# Altium project MacroQMK.PrjPcb
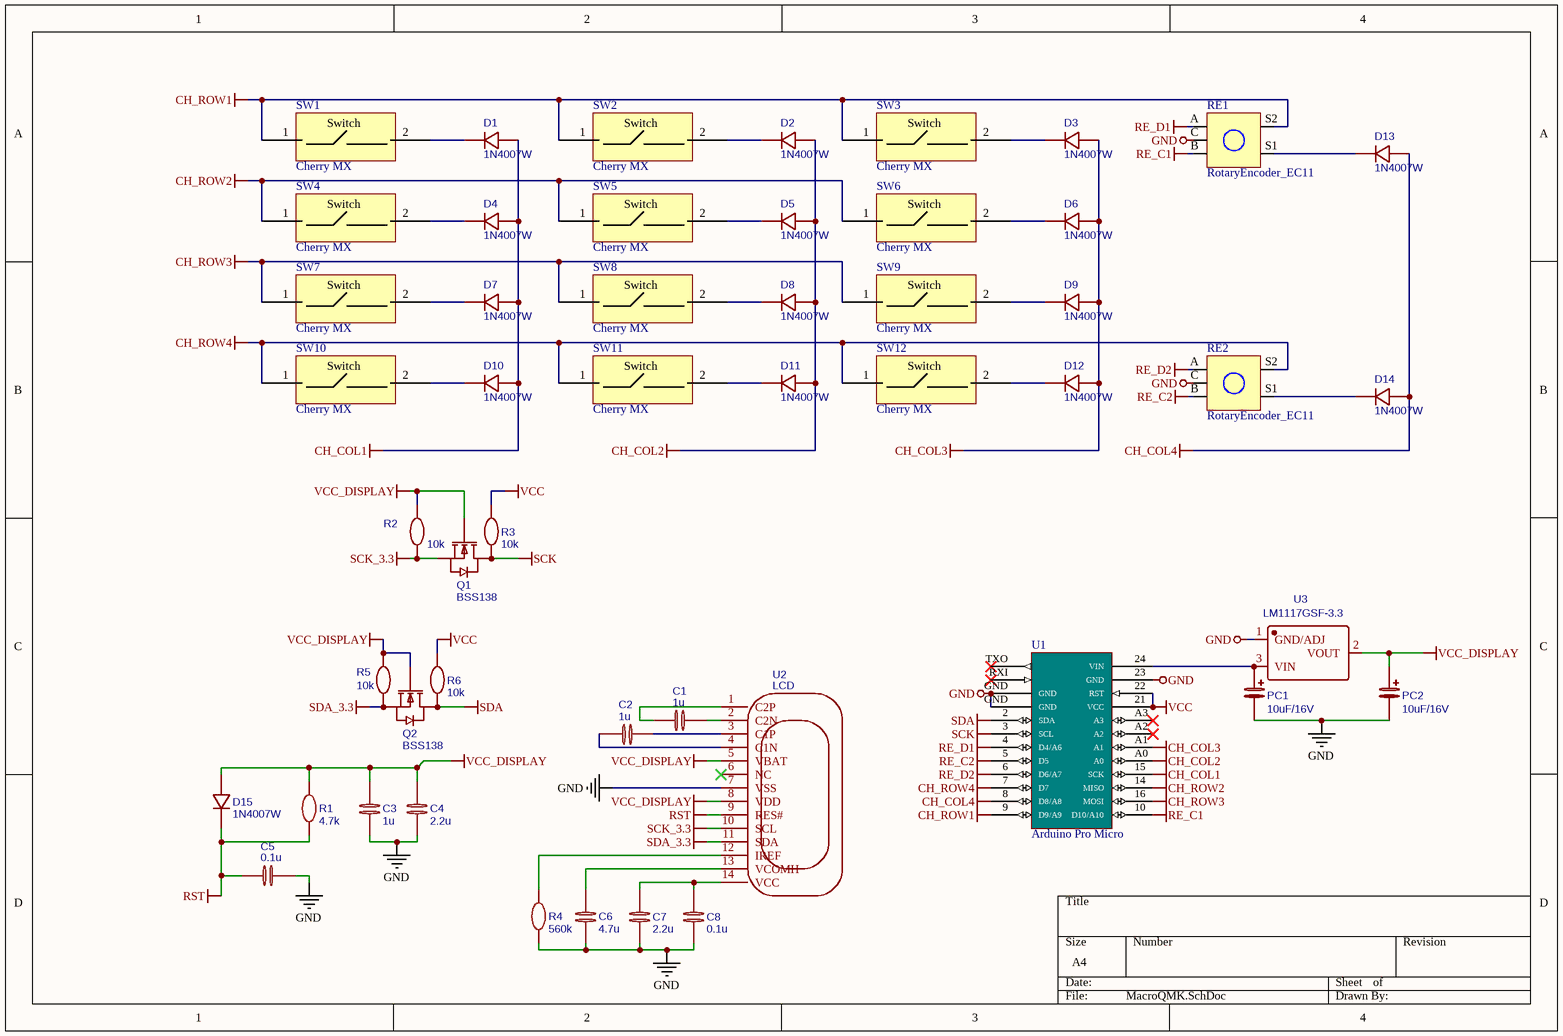
[diagram p0: MacroQMK.SchDoc]
1 sheet, 50 parts. Net scope: global (net labels, ports and power ports of the same name join across sheets).
Board file: MacroQMK.PcbDoc

## Sheet MacroQMK.SchDoc
size A4; SheetNumber: 1; SheetTotal: 1

### Parts
C1  1u  [C0603]
C2  1u  [C0603]
C3  1u  [C0603]
C4  2.2u  [C0603]
C5  0.1u  [C0603]
C6  4.7u  [C0603]
C7  2.2u  [C0603]
C8  0.1u  [C0603]
D1  1N4007W  [SOD123F]
D2  1N4007W  [SOD123F]
D3  1N4007W  [SOD123F]
D4  1N4007W  [SOD123F]
D5  1N4007W  [SOD123F]
D6  1N4007W  [SOD123F]
D7  1N4007W  [SOD123F]
D8  1N4007W  [SOD123F]
D9  1N4007W  [SOD123F]
D10  1N4007W  [SOD123F]
D11  1N4007W  [SOD123F]
D12  1N4007W  [SOD123F]
D13  1N4007W  [SOD123F]
D14  1N4007W  [SOD123F]
D15  1N4007W  [SOD123F]
PC1  10uF/16V  [CAP POL 1206_3216]
PC2  10uF/16V  [CAP POL 1206_3216]
Q1  BSS138  [MICROCHIP SOT-23-3 NB]
Q2  BSS138  [MICROCHIP SOT-23-3 NB]
R1  4.7k  [RES 0402_1005]
R2  10k  [R0603]
R3  10k  [R0603]
R4  560k  [R0603]
R5  10k  [R0603]
R6  10k  [R0603]
RE1  RotaryEncoder_EC11  [RotaryEncoder_EC11]
RE2  RotaryEncoder_EC11  [RotaryEncoder_EC11]
SW1  Cherry MX  [MX_Cherry]
SW2  Cherry MX  [MX_Cherry]
SW3  Cherry MX  [MX_Cherry]
SW4  Cherry MX  [MX_Cherry]
SW5  Cherry MX  [MX_Cherry]
SW6  Cherry MX  [MX_Cherry]
SW7  Cherry MX  [MX_Cherry]
SW8  Cherry MX  [MX_Cherry]
SW9  Cherry MX  [MX_Cherry]
SW10  Cherry MX  [MX_Cherry]
SW11  Cherry MX  [MX_Cherry]
SW12  Cherry MX  [MX_Cherry]
U1  Arduino Pro Micro  [ArduinoProMicro]
U2  LCD  [GCT FFC2B28-14]
U3  LM1117GSF-3.3  [NEXPERIA SOT-223 BZV90]

### Nets
CH_COL1: D1.2 D4.2 D7.2 D10.2 U1.15(SCK)
CH_COL2: D2.2 D5.2 D8.2 D11.2 U1.A0
CH_COL3: D3.2 D6.2 D9.2 D12.2 U1.A1
CH_COL4: D13.2 D14.2 U1.8(D8/A8)
CH_ROW1: RE1.S2 SW1.1 SW2.1 SW3.1 U1.9(D9/A9)
CH_ROW2: SW4.1 SW5.1 SW6.1 U1.14(MISO)
CH_ROW3: SW7.1 SW8.1 SW9.1 U1.16(MOSI)
CH_ROW4: RE2.S2 SW10.1 SW11.1 SW12.1 U1.7(D7)
GND: C3.1 C4.1 C5.2 C6.1 C7.1 C8.1 PC1.2 PC2.2 R4.1 RE1.C RE2.C U1.23(GND) U1.GND U2.7(VSS) U3.1(GND/ADJ)
RE_C1: RE1.B U1.10(D10/A10)
RE_C2: RE2.B U1.5(D5)
RE_D1: RE1.A U1.4(D4/A6)
RE_D2: RE2.A U1.6(D6/A7)
RST: C5.1 D15.1 R1.1 U2.9(RES#)
SCK: Q1.3(D) R3.2 U1.3(SCL)
SCK_3.3: Q1.2(S) R2.2 U2.10(SCL)
SDA: Q2.3(D) R6.2 U1.2(SDA)
SDA_3.3: Q2.2(S) R5.2 U2.11(SDA)
VCC: R3.1 R6.1 U1.21(VCC) U1.22(RST)
VCC_DISPLAY: C3.2 C4.2 D15.2 PC2.1 Q1.1(G) Q2.1(G) R1.2 R2.1 R5.1 U2.5(VBAT) U2.8(VDD) U3.2(VOUT)
NetC1_1: C1.1 U2.1(C2P)
NetC1_2: C1.2 U2.2(C2N)
NetC2_1: C2.1 U2.3(C1P)
NetC2_2: C2.2 U2.4(C1N)
NetC6_2: C6.2 U2.13(VCOMH)
NetC7_2: C7.2 C8.2 U2.14(VCC)
NetD1_1: D1.1 SW1.2
NetD2_1: D2.1 SW2.2
NetD3_1: D3.1 SW3.2
NetD4_1: D4.1 SW4.2
NetD5_1: D5.1 SW5.2
NetD6_1: D6.1 SW6.2
NetD7_1: D7.1 SW7.2
NetD8_1: D8.1 SW8.2
NetD9_1: D9.1 SW9.2
NetD10_1: D10.1 SW10.2
NetD11_1: D11.1 SW11.2
NetD12_1: D12.1 SW12.2
NetD13_1: D13.1 RE1.S1
NetD14_1: D14.1 RE2.S1
NetPC1_1: PC1.1 U1.24(VIN) U3.3(VIN)
NetR4_2: R4.2 U2.12(IREF)

Not connected (* = marked no-connect by the designer): U1 A2* A3* RXI* TXO*; U2 6(NC)*

### Notes on the sheet
- (in symbol MX_Cherry) Switch

### Library data of the parts
C1-C3 = 1u: nameAlias: Value(F); Contributor: LCEDA_Lib; spicePre: C; spiceSymbolName: C_0603_EU
C4 C7 = 2.2u: nameAlias: Value(F); Contributor: LCEDA_Lib; spicePre: C; spiceSymbolName: C_0603_EU
C5 C8 = 0.1u: nameAlias: Value(F); Contributor: LCEDA_Lib; spicePre: C; spiceSymbolName: C_0603_EU
C6 = 4.7u: nameAlias: Value(F); Contributor: LCEDA_Lib; spicePre: C; spiceSymbolName: C_0603_EU
D1-D15 = 1N4007W: BOM_Manufacturer: BLUE ROCKET; Contributor: LCEDA_Lib; BOM_Supplier: LCSC; BOM_Supplier Part: C328592; BOM_Manufacturer Part: 1N4007W; spicePre: D; spiceSymbolName: 1N4007W
PC1 = 10uF/16V: nameAlias: Value(F); Package Display: No; BOM_Manufacturer Part: ?; spicePre: C; spiceSymbolName: Capacitor
PC2 = 10uF/16V: nameAlias: Value(F); BOM_Manufacturer Part: ?; spicePre: C; spiceSymbolName: Capacitor
Q1 Q2 = BSS138: BOM_Manufacturer: ON; BOM_Manufacturer Part: BSS138LT1G; SMT Type: Extend; BOM_Paste Type: recommend; BOM_Supplier: LCSC; BOM_Supplier Part: C82045; BOM_JLCPCB SMD: Yes; spicePre: Q; spiceSymbolName: BSS138LT1G
R1 = 4.7k: nameAlias: Value(Ω); Contributor: LCEDA_Lib; spicePre: R; spiceSymbolName: R_0603_EU
R2 R3 R5 R6 = 10k: nameAlias: Value(Ω); Contributor: LCEDA_Lib; spicePre: R; spiceSymbolName: R_0603_EU
R4 = 560k: nameAlias: Value(Ω); Contributor: LCEDA_Lib; spicePre: R; spiceSymbolName: R_0603_EU
SW1-SW12 = MX_Cherry
U1 = ArduinoProMicro
U2 = LCD: Contributor: Jose Manuel Ordo?ez Gongora; spicePre: U; spiceSymbolName: LCD
U3 = LM1117GSF-3.3: BOM_Manufacturer: HTC Korea TAEJIN Tech; Contributor: LCSC; BOM_Paste Type: expand; Package Display: No; BOM_Supplier: LCSC; BOM_Supplier Part: C481677; BOM_Manufacturer Part: LM1117GSF-3.3; spicePre: U; spiceSymbolName: LM1117GSF-3.3